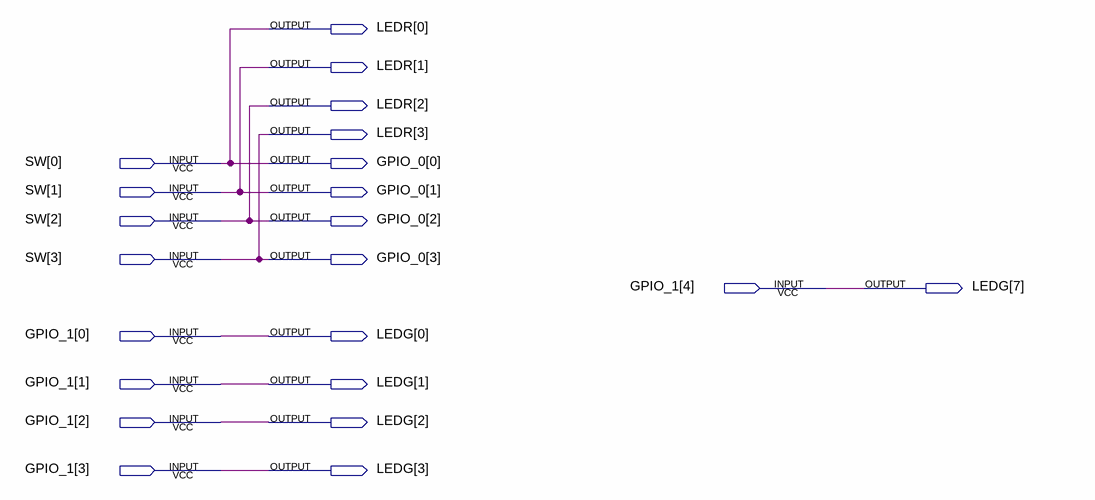
[diagram p0: schematic sheet]
// Quartus schematic TesteTeclado.bdf as structural Verilog: 0 symbols, 22 pins
module TesteTeclado (
  input  [3:0] SW,
  input  [4:0] GPIO_1,
  output [3:0] LEDR,
  output [3:0] GPIO_0,
  output [7:0] LEDG
);


  assign GPIO_0 = SW;
  assign {LEDG[7], LEDG[3:0]} = GPIO_1;
  assign LEDR = SW;
endmodule
